# Altium project SCH-9013203-000A.PrjPCB
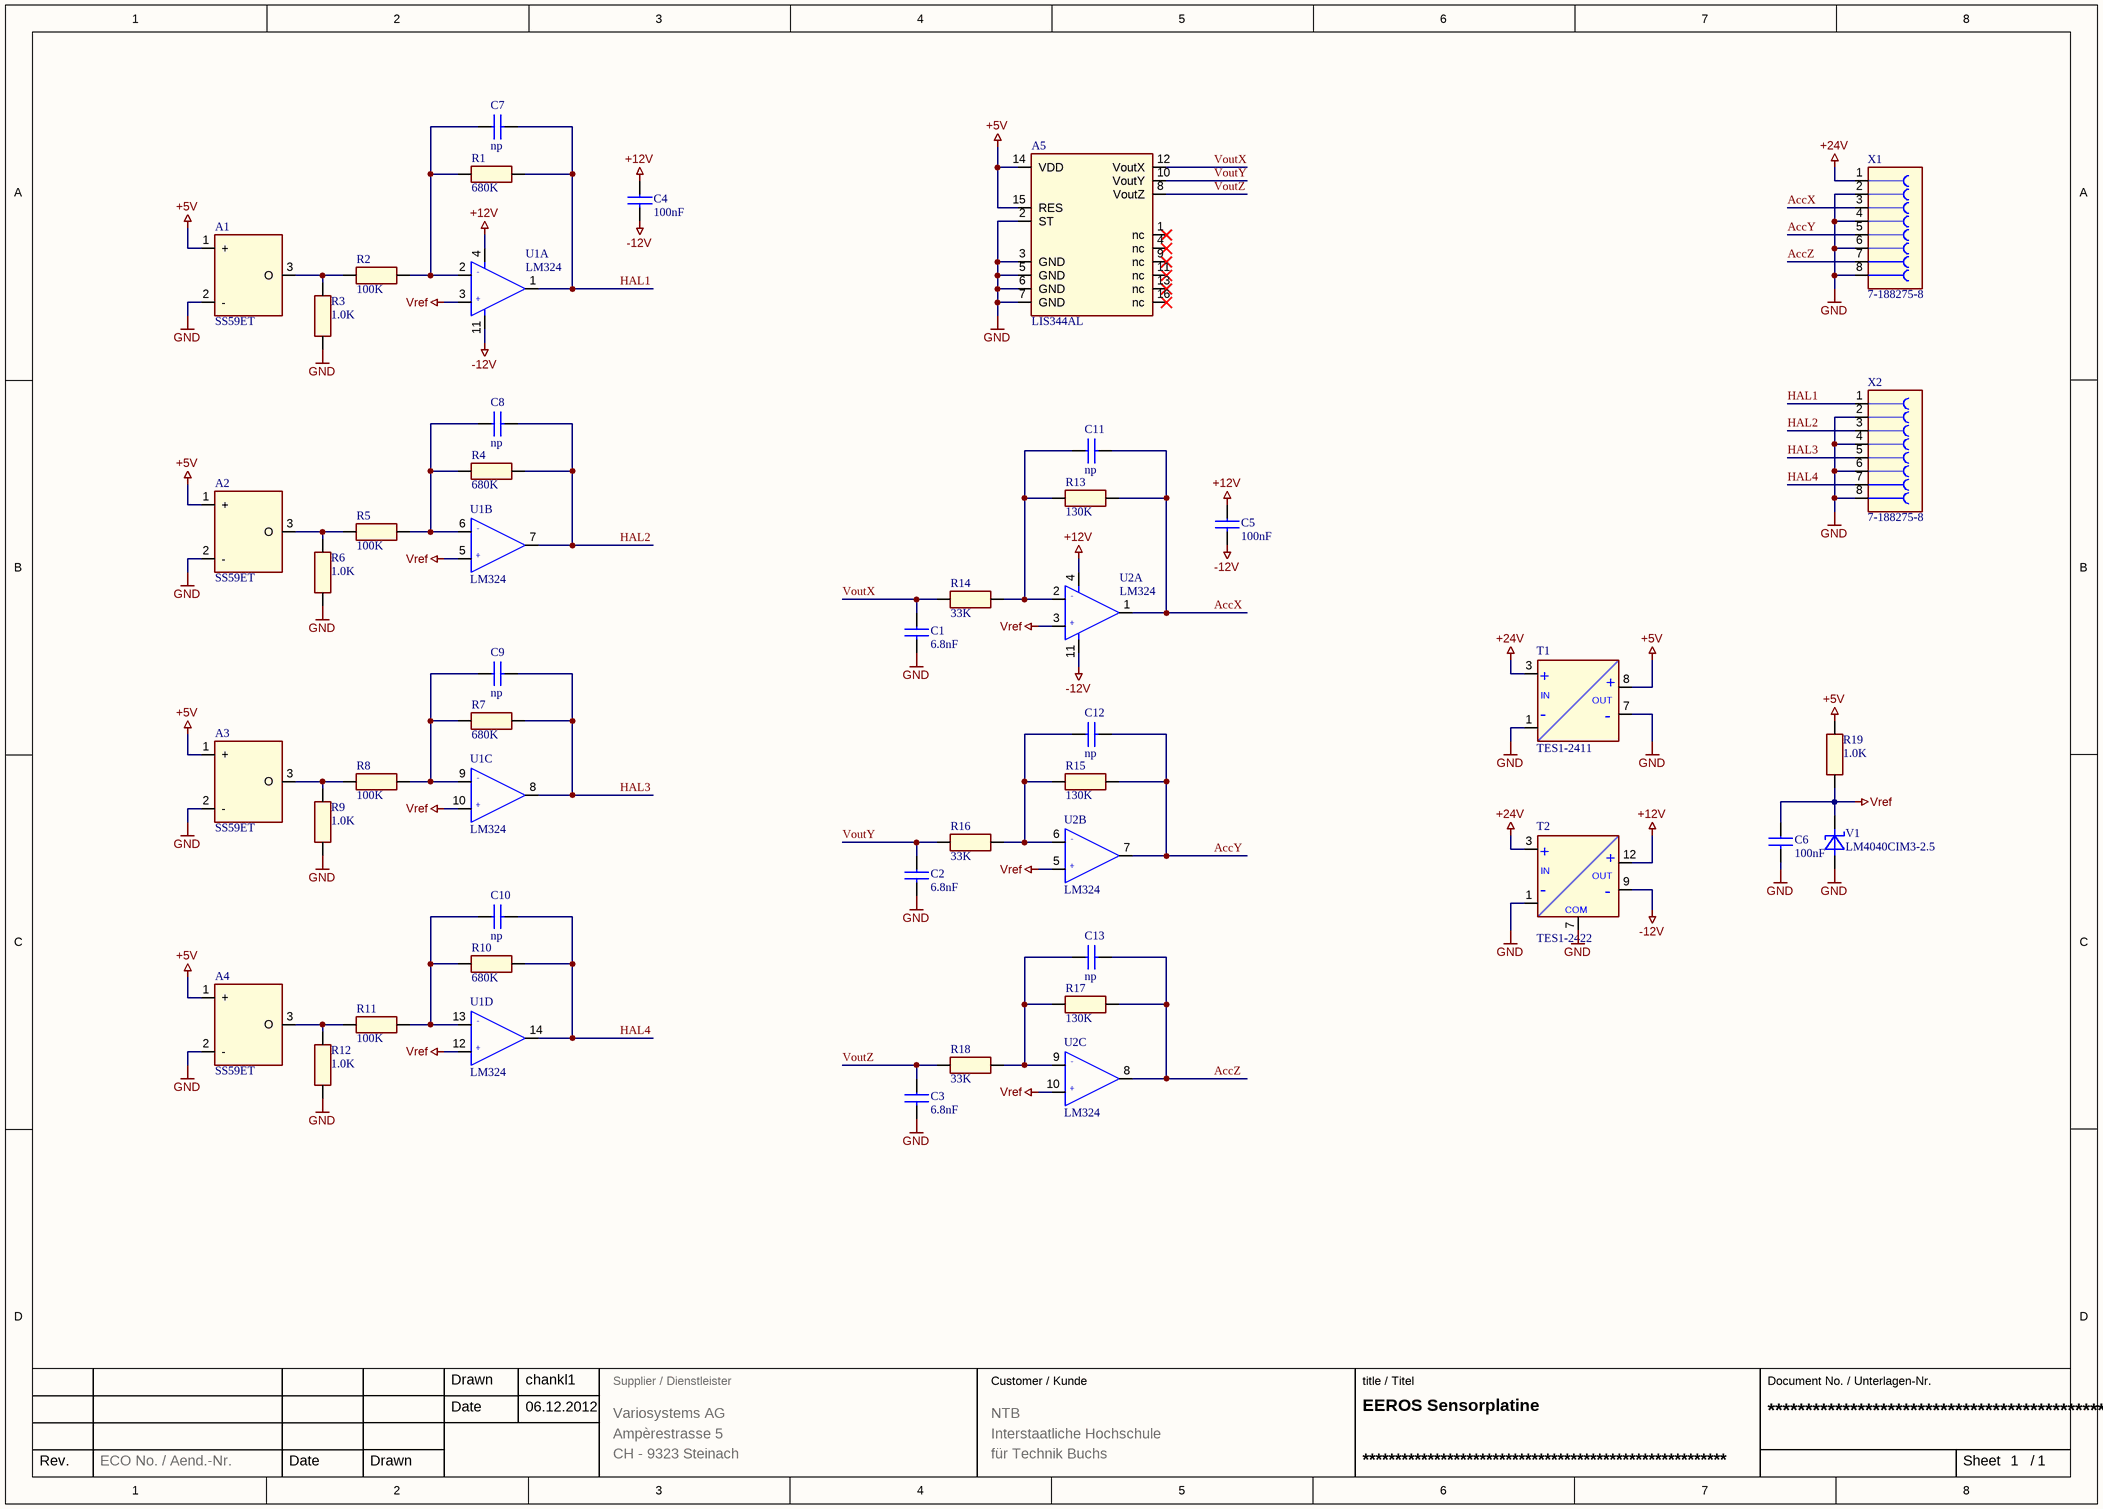
[diagram p0: EEROS_Sensorplatine.SchDoc]
1 sheet, 44 parts. Net scope: global (net labels, ports and power ports of the same name join across sheets).
Board file: PCB-2024316-000A_NTB.pcbdoc

## Sheet EEROS_Sensorplatine.SchDoc: ********************************************************
size A3; Date: 06.12.2012; ApprovedBy: ********************************************************; CheckedBy: ********************************************************; Author: ********************************************************; CompanyName: ********************************************************; DrawnBy: chankl1; Engineer: ********************************************************; Organization: ********************************************************; Address1: ********************************************************; Address2: ********************************************************; Address3: ********************************************************; Address4: ********************************************************; DocumentNumber: ********************************************************; Revision: ********************************************************; SheetNumber: 1; SheetTotal: 1; Title1: EEROS Sensorplatine; CurrentTime: ********************************************************; CurrentDate: ********************************************************; Time: ********************************************************; DocumentFullPathAndName: ********************************************************; DocumentName: ********************************************************; ModifiedDate: ********************************************************; ImagePath: ********************************************************; ProjectName: *********************************************; Rule: PcbType=ProtelPcb

### Parts
A1  SS59ET  [SM/SOT89_1234]
A2  SS59ET  [SM/SOT89_1234]
A3  SS59ET  [SM/SOT89_1234]
A4  SS59ET  [SM/SOT89_1234]
A5  LIS344AL  [QFN.65M/16/WG4.00]
C1  6.8nF  [SM/C_0603_REFLOW]
C2  6.8nF  [SM/C_0603_REFLOW]
C3  6.8nF  [SM/C_0603_REFLOW]
C4  100nF  [SM/C_0603_REFLOW]
C5  100nF  [SM/C_0603_REFLOW]
C6  100nF  [SM/C_0603_REFLOW]
C7  np  [SM/C_0603_REFLOW]
C8  np  [SM/C_0603_REFLOW]
C9  np  [SM/C_0603_REFLOW]
C10  np  [SM/C_0603_REFLOW]
C11  np  [SM/C_0603_REFLOW]
C12  np  [SM/C_0603_REFLOW]
C13  np  [SM/C_0603_REFLOW]
R1  680K  [SM/R_0603_REFLOW]
R2  100K  [SM/R_0603_REFLOW]
R3  1.0K  [SM/R_0603_REFLOW]
R4  680K  [SM/R_0603_REFLOW]
R5  100K  [SM/R_0603_REFLOW]
R6  1.0K  [SM/R_0603_REFLOW]
R7  680K  [SM/R_0603_REFLOW]
R8  100K  [SM/R_0603_REFLOW]
R9  1.0K  [SM/R_0603_REFLOW]
R10  680K  [SM/R_0603_REFLOW]
R11  100K  [SM/R_0603_REFLOW]
R12  1.0K  [SM/R_0603_REFLOW]
R13  130K  [SM/R_0603_REFLOW]
R14  33K  [SM/R_0603_REFLOW]
R15  130K  [SM/R_0603_REFLOW]
R16  33K  [SM/R_0603_REFLOW]
R17  130K  [SM/R_0603_REFLOW]
R18  33K  [SM/R_0603_REFLOW]
R19  1.0K  [SM/R_0603_REFLOW]
T1  TES1-2411  [TES1_SINGLE]
T2  TES1-2422  [TES1_DUAL]
U1  LM324  [SOG.050/14/WG.244/L.350]  (parts A,B,C,D of 4)
U2  LM324  [SOG.050/14/WG.244/L.350]  (parts A,B,C of 4)
V1  LM4040CIM3-2.5  [SM/SOT23_123]
X1  7-188275-8  [MICRO-MATCH_8P_SMD]
X2  7-188275-8  [MICRO-MATCH_8P_SMD]

### Nets
+5V: A1.1(+) A2.1(+) A3.1(+) A4.1(+) A5.14(VDD) A5.15(RES) R19.1 T1.8
+12V: C4.1 C5.1 T2.12 U1.4(VCC) U2.4(VCC)
+24V: T1.3 T2.3 X1.1
-12V: C4.2 C5.2 T2.9 U1.11(GND) U2.11(GND)
GND: A1.2(-) A2.2(-) A3.2(-) A4.2(-) A5.2(ST) A5.3(GND) A5.5(GND) A5.6(GND) A5.7(GND) C1.2 C2.2 C3.2 C6.2 R3.2 R6.2 R9.2 R12.2 T1.1 T1.7 T2.1 T2.7 V1.2(A) X1.2 X1.4 X1.6 X1.8 X2.2 X2.4 X2.6 X2.8
Vref: C6.1 R19.2 U1.3(+IN) U1.5(+IN) U1.10(+IN) U1.12(+IN) U2.3(+IN) U2.5(+IN) U2.10(+IN) V1.1(K)
AccX: C11.2 R13.2 U2.1(OUT) X1.3
AccY: C12.2 R15.2 U2.7(OUT) X1.5
AccZ: C13.2 R17.2 U2.8(OUT) X1.7
HAL1: C7.2 R1.2 U1.1(OUT) X2.1
HAL2: C8.2 R4.2 U1.7(OUT) X2.3
HAL3: C9.2 R7.2 U1.8(OUT) X2.5
HAL4: C10.2 R10.2 U1.14(OUT) X2.7
VoutX: A5.12(VoutX) C1.1 R14.1
VoutY: A5.10(VoutY) C2.1 R16.1
VoutZ: A5.8(VoutZ) C3.1 R18.1
NetA1_3: A1.3(O) R2.1 R3.1
NetA2_3: A2.3(O) R5.1 R6.1
NetA3_3: A3.3(O) R8.1 R9.1
NetA4_3: A4.3(O) R11.1 R12.1
NetC7_1: C7.1 R1.1 R2.2 U1.2(-IN)
NetC8_1: C8.1 R4.1 R5.2 U1.6(-IN)
NetC9_1: C9.1 R7.1 R8.2 U1.9(-IN)
NetC10_1: C10.1 R10.1 R11.2 U1.13(-IN)
NetC11_1: C11.1 R13.1 R14.2 U2.2(-IN)
NetC12_1: C12.1 R15.1 R16.2 U2.6(-IN)
NetC13_1: C13.1 R17.1 R18.2 U2.9(-IN)

Not connected (* = marked no-connect by the designer): A5 1(nc)* 4(nc)* 9(nc)* 11(nc)* 13(nc)* 16(nc)*

### Notes on the sheet
- Drawn
- Supplier / Dienstleister
- Customer / Kunde
- title / Titel
- Document No. / Unterlagen-Nr.
- Date
- Variosystems AG
- Ampèrestrasse 5
- CH - 9323 Steinach
- NTB
- Interstaatliche Hochschule
- für Technik Buchs
- Rev.
- ECO No. / Aend.-Nr.
- Sheet
- /
- (in symbol 204061, part A) -; +
- (in symbol 204061, part B) -; +
- (in symbol 204061, part C) -; +
- (in symbol 204061, part D) -; +
- (in symbol 2024319) +; IN; OUT; -
- (in symbol 2024320) +; IN; OUT; -; COM

### Library data of the parts
A1-A4 = 2024317: S_ SEN MAGNE SS59ET_________________ ___; Manufacturer: Honeywell; Cust: Y; Part Number: 2024317; Part Type: IC-Analog\Datenerfassung; HTNr: SS59ET; Datasheet: S:\Datenb\DS-2024317-000A.pdf
A5 = 2024318: S_ SEN ACCEL LIS344AL_______________ ___; Manufacturer: STMicrolectronics; Cust: Y; Part Number: 2024318; Part Type: IC-Analog\Datenerfassung; HTNr: LIS344AL; Datasheet: S:\Datenb\DS-2024318-000A.pdf
C1-C3 = 239551: SC CAP __0603 __6n80 _50V ___10% X7R ___; Part Number: 239551; Manufacturer: Generic Component; Voltage: 50V; Tolerance: 10%; Cust: Y; Std: STD SET; HTNr: take notice of key data; Part Type: CAP-SMD\Keramik\0603
C4-C6 = 208013: SC CAP __0603 100N00 _25V 80/20% Y5V ___; Part Number: 208013; Manufacturer: Generic Component; Voltage: 25V; Cust: Y; HTNr: take notice of key data; Part Type: CAP-SMD\Keramik\0603; Tolerance: 80/20%; Std: STD
C7-C13 = CAP NP
R1 R4 R7 R10 = 226186: SC RES __0603 680K00 __0W1 ___1% T100 __; Part Number: 226186; Manufacturer: Generic Component; Power: 0.1W; Tolerance: 1%; Cust: Y; Std: SET; HTNr: take notice of key data; Part Type: RES-SMD\0603
R2 R5 R8 R11 = 200141: SC RES __0603 100K00 __0W1 ___1% T100 __; Part Number: 200141; Manufacturer: Generic Component; Power: 0.1W; Tolerance: 1%; Cust: Y; Std: STD SET; HTNr: take notice of key data; Part Type: RES-SMD\0603
R3 R6 R9 R12 R19 = 200139: SC RES __0603 __1K00 __0W1 ___1% T100 __; Part Number: 200139; Manufacturer: Generic Component; Power: 0.1W; Tolerance: 1%; Cust: Y; Std: STD SET; HTNr: take notice of key data; Part Type: RES-SMD\0603
R13 R15 R17 = 240657: SC RES __0603 130K00 __0W1 ___1% T100 __; Part Number: 240657; Manufacturer: Generic Component; Power: 0.1W; Tolerance: 1%; Cust: Y; Std: SET; HTNr: take notice of key data; Part Type: RES-SMD\0603
R14 R16 R18 = 204505: SC RES __0603 _33K00 __0W1 ___1% T100 __; Part Number: 204505; Manufacturer: Generic Component; Power: 0.1W; Tolerance: 1%; Cust: Y; Std: STD SET; HTNr: take notice of key data; Part Type: RES-SMD\0603
T1 = 2024319: SS CNV TES1-2411________ _____5V _1W0 DD; Manufacturer: Traco; Part Number: 2024319; Part Type: MISC-Converter; HTNr: TES1-2411; Datasheet: S:\Datenb\DS-2010889-000A.pdf
T2 = 2024320: SD CNV TES1-2422________ _+/-12V _1W0 DD; Manufacturer: Traco; Part Number: 2024320; Part Type: MISC-Converter; HTNr: TES1-2422; Datasheet: S:\Datenb\DS-2010889-000A.pdf
U1 U2 = 204061: S_ IC_ _____SO14 LM324M*/NOPB________ __; Part Number: 204061; Manufacturer: National Semiconductor; Cust: Y; Part Type: IC-Analog\Signalverarbeitung; Std: STD; HTNr: LM324M*/NOPB; Datasheet: S:\Datenb\DS-221202-000A.pdf
V1 = 206446: S_ IC_ ____SOT23 LM4040CIM3-2.5/NOPB_ __; Part Number: 206446; Manufacturer: National Semiconductor; Cust: Y; Part Type: DISCR-Z-Diode\SMD; HTNr: LM4040CIM3-2.5/NOPB; Datasheet: S:\Datenb\DS-226794-000B.pdf
X1 X2 = 249627: S_ CON F ST ____ ___8P ____ __ R1.27 ___; Part Number: 249627; Manufacturer: AMP Inc.; HTNr: 7-188275-8/0-188275-8; Part Type: MISC-Connectors\Diverse; Datasheet: S:\Datenb\DS-221287-000A.pdf